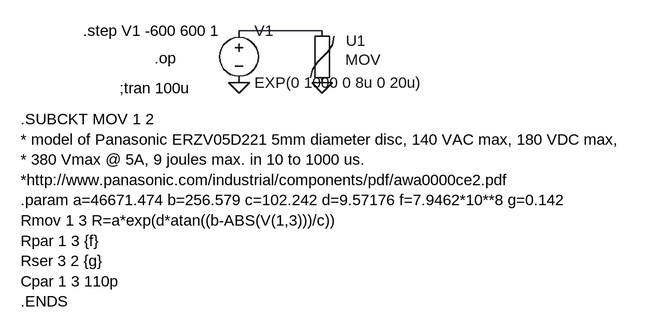
[diagram p0: schematic MOVa.asc]
MOVa.asc, the LTspice schematic file:
Version 4
SHEET 1 880 680
WIRE 256 80 128 80
FLAG 256 160 0
FLAG 128 160 0
SYMBOL voltage 128 64 R0
WINDOW 123 0 0 Left 0
WINDOW 39 0 0 Left 0
SYMATTR InstName V1
SYMATTR Value EXP(0 1000 0 8u 0 20u)
SYMBOL MOV 240 64 R0
SYMATTR InstName U1
TEXT -208 216 Left 0 !.SUBCKT MOV 1 2\n* model of Panasonic ERZV05D221 5mm diameter disc, 140 VAC max, 180 VDC max, \n* 380 Vmax @ 5A, 9 joules max. in 10 to 1000 us. \n*http://www.panasonic.com/industrial/components/pdf/awa0000ce2.pdf\n.param a=46671.474 b=256.579 c=102.242 d=9.57176 f=7.9462*10**8 g=0.142\nRmov 1 3 R=a*exp(d*atan((b-ABS(V(1,3)))/c))\nRpar 1 3 {f}\nRser 3 2 {g}\nCpar 1 3 110p\n.ENDS
TEXT -2 122 Left 0 !.op
TEXT -112 80 Left 0 !.step V1 -600 600 1
TEXT -56 168 Left 0 !;tran 100u

The netlist it stands for:
* MOVa.asc
V1 N001 0 EXP(0 1000 0 8u 0 20u)
XU1 N001 0 MOV  ; pins A B
.SUBCKT MOV 1 2
* model of Panasonic ERZV05D221 5mm diameter disc, 140 VAC max, 180 VDC max,
* 380 Vmax @ 5A, 9 joules max. in 10 to 1000 us.
*http://www.panasonic.com/industrial/components/pdf/awa0000ce2.pdf
.param a=46671.474 b=256.579 c=102.242 d=9.57176 f=7.9462*10**8 g=0.142
Rmov 1 3 R=a*exp(d*atan((b-ABS(V(1,3)))/c))
Rpar 1 3 {f}
Rser 3 2 {g}
Cpar 1 3 110p
.ENDS
.op
.step V1 -600 600 1
;tran 100u
.backanno
.end